# EasyEDA Pro project Magmattic PCB_V2.eprj, schematic 849Amp
Board Name: AmpOnly; Create Date: 2025-03-20; Page Name: P1; Project Name: Magmattic PCB_V2; Schematic Name: AmpOnly; Update Date: 2025-03-31; Company: EasyEDA.com; Page Size: A4; Version: V1.0
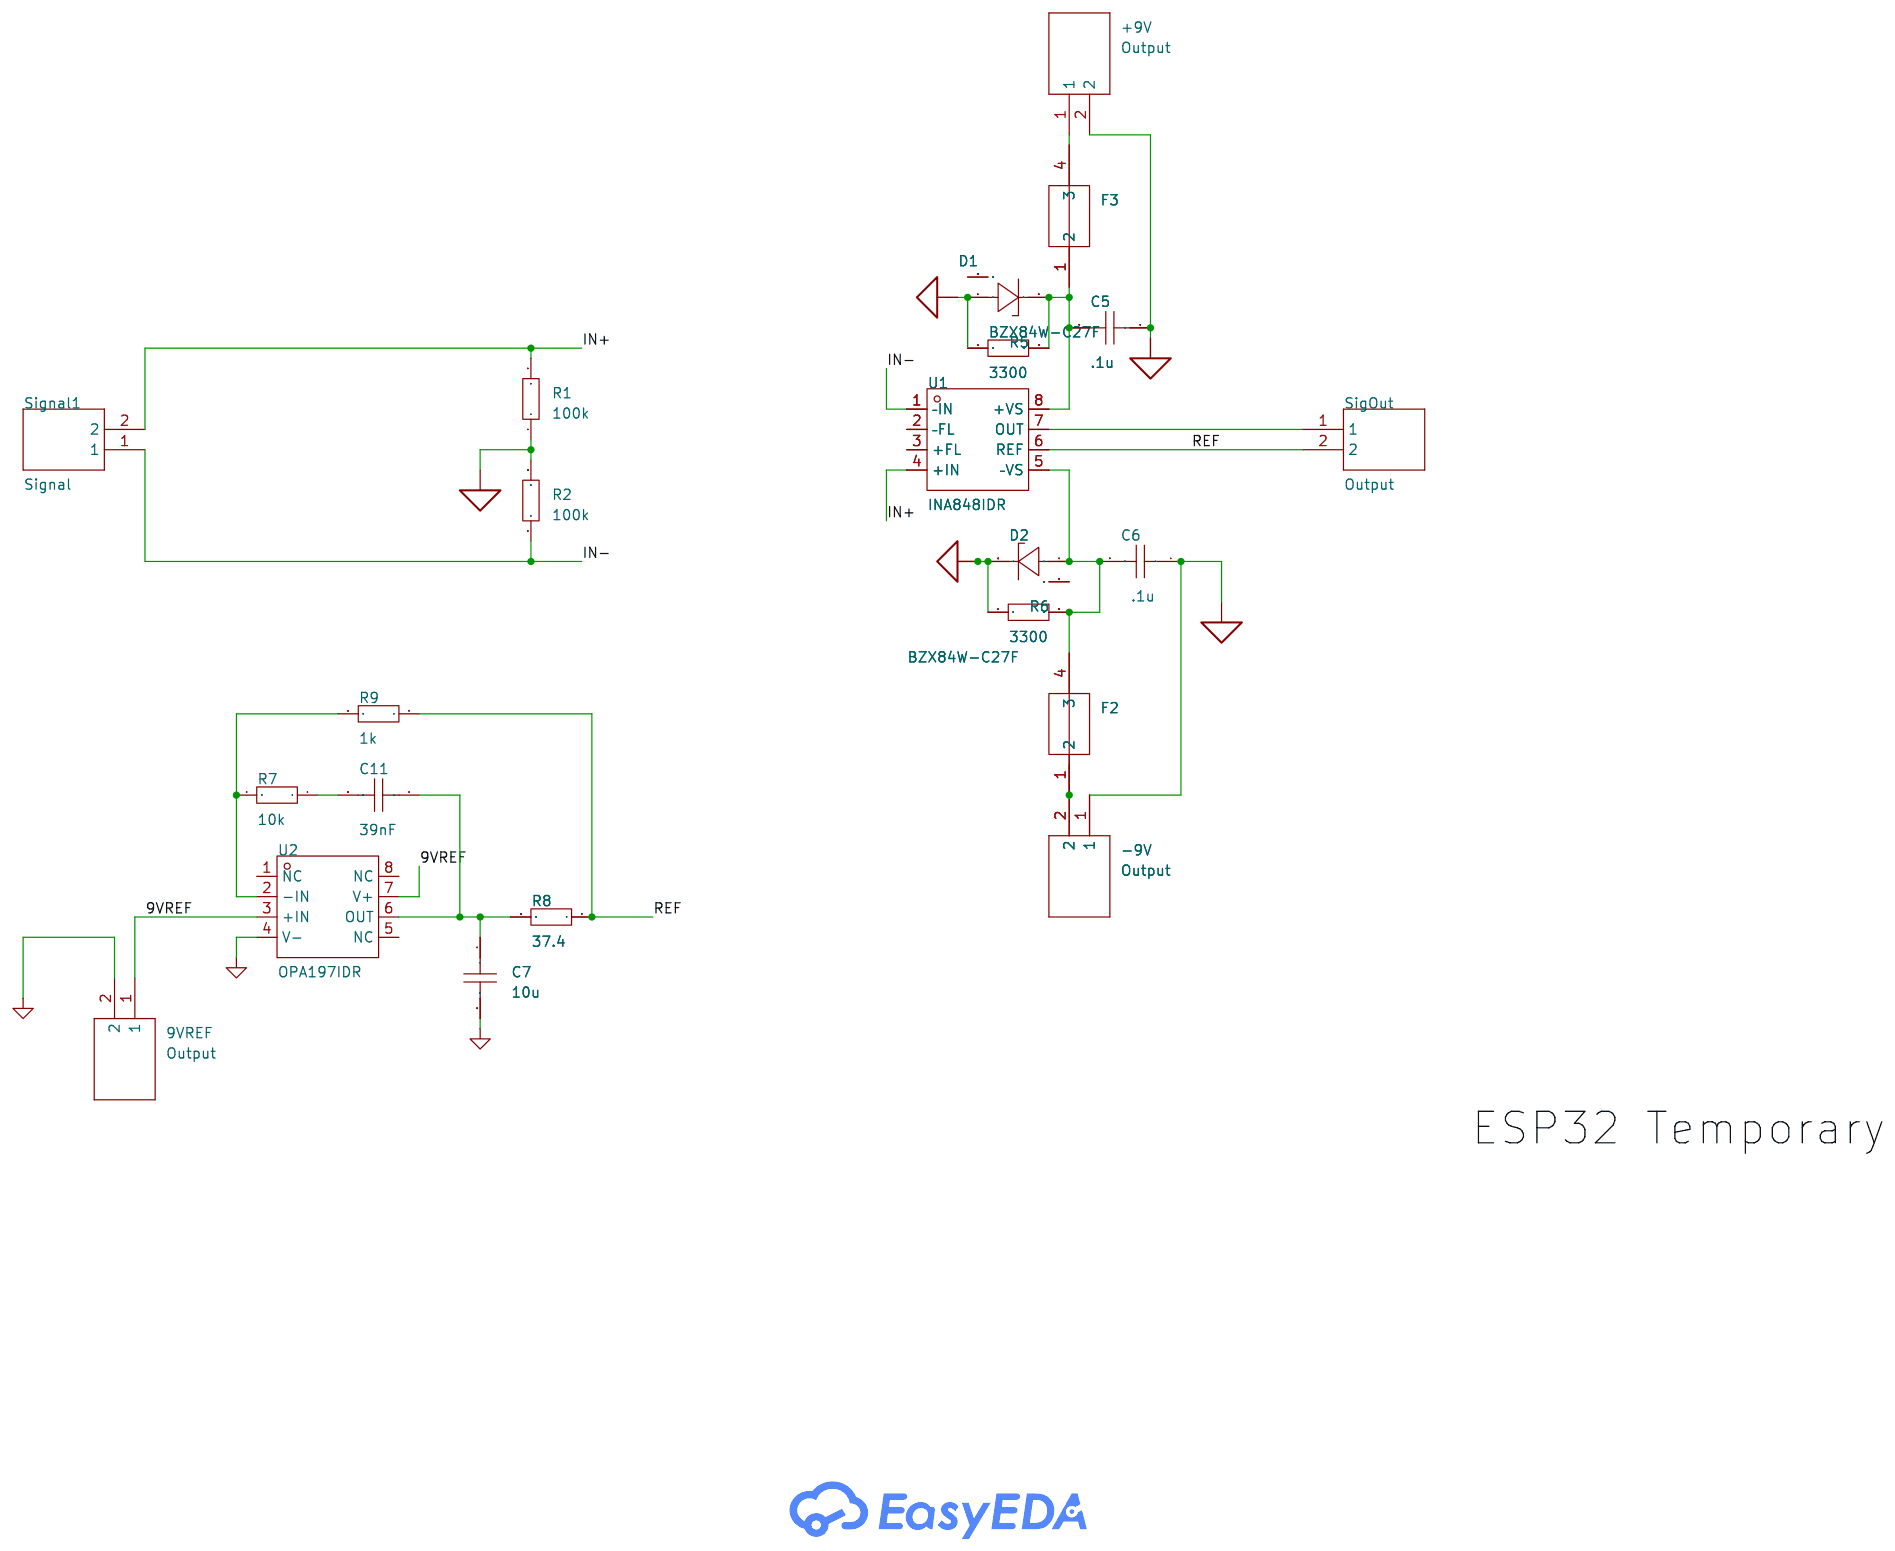
[diagram p2: schematic sheet]

## Parts
9VREF  Output  [CUI_TB002-500-02BE]
+9V  Output  [CUI_TB002-500-02BE]
-9V  Output  [CUI_TB002-500-02BE]
C5  .1u  [C0603]
C6  .1u  [C0603]
C7  10u  [C0603]
C11  39nF  [C0603]
D1  BZX84W-C27F  [SOT-323-3_L2.0-W1.3-P1.30-LS2.1-BR]
D2  BZX84W-C27F  [SOT-323-3_L2.0-W1.3-P1.30-LS2.1-BR]
F2  -  [10mA Fuse]
F3  -  [10mA Fuse]
R1  100k  [R0603]
R2  100k  [R0603]
R5  3300  [R0603]
R6  3300  [R0603]
R7  10k  [R0603]
R8  37.4  [R0603]
R9  1k  [R0603]
Signal1  Signal  [CUI_TB002-500-02BE]
SigOut  Output  [CUI_TB002-500-02BE]
U1  INA848IDR  [SOIC-8_L4.9-W3.9-P1.27-LS6.0-BL]
U2  OPA197IDR  [SOIC-8_L4.9-W3.9-P1.27-LS6.0-BL]

## Library data of the parts
9VREF +9V -9V Signal1 SigOut = TB002-500-02BE
C5-C7 C11 = CAP_0603: Supplier Footprint: 0603
D1 D2 = BZX84W-C27F: Supplier Part: C551128; Manufacturer: Nexperia(安世); Supplier Footprint: SOT-323-3; JLCPCB Part Class: Extended Part; Datasheet: https://atta.szlcsc.com/upload/public/pdf/source/20240725/E6262E2E8B4D52267EA63ABF1EAAA53A.pdf; Supplier: LCSC; Zener Voltage (Nom): 27V; Reverse Leakage Current (Ir): 50nA@18.9V; Power Dissipation: 275mW; Zener Impedance (Zzt): 80Ω
F2 F3 = 10mA Fuse
R1 R2 R5-R9 = Res_0603: Supplier Footprint: 0603
U1 = INA848IDR: Supplier Part: C2866115; Manufacturer: TI(德州仪器); Supplier Footprint: SOIC-8; JLCPCB Part Class: Extended Part; Datasheet: https://www.ti.com/cn/lit/gpn/ina848; Supplier: LCSC
U2 = OPA197IDR: Supplier Part: C79274; Manufacturer: TI(德州仪器); Supplier Footprint: SOIC-8; JLCPCB Part Class: Extended Part; Datasheet: https://www.ti.com/cn/lit/gpn/opa197; Supplier: LCSC; Number of Circuits: Single channel; Gain Bandwidth Product(GBP): 10MHz; Current - Input Bias(Ib): 5pA; Slew Rate(SR): 20V/us; Operating Temperature: -40℃~+125℃

## Nets
9VREF: 9VREF.1 U2.3(+IN) U2.7(V+)
AMPGND: +9V.2 -9V.1 C5.1 C6.1 D1.1(A) D2.3(K) R1.1 R2.2 R5.1 R6.1
BB-ADS1262-REV.A_GNDD: 9VREF.2 C7.2 U2.4(V-)
IN+: R1.2 Signal1.2 U1.4(+IN)
IN-: R2.1 Signal1.1 U1.1(–IN)
REF: R8.1 R9.1 SigOut.2 U1.6(REF)
$1N821: C5.2 D1.3(K) F3.1(2) R5.2 U1.8(+VS)
$1N3596: SigOut.1 U1.7(OUT)
$1N6194: -9V.2 F2.1(2)
$1N6926: C6.2 D2.1(A) F2.4(3) R6.2 U1.5(–VS)
$1N8365: C7.1 C11.1 R8.2 U2.6(OUT)
$1N8366: R7.2 R9.2 U2.2(-IN)
$1N8369: C11.2 R7.1
$1N9226: +9V.1 F3.4(3)

Not connected (* = marked no-connect by the designer): D1 2(NC); D2 2(NC); U1 2(–FL) 3(+FL); U2 1(NC) 5(NC) 8(NC)

## Notes on the sheet
- ESP32 Temporary
